# EAGLE design PosiBus (EAGLE 6.6.0)
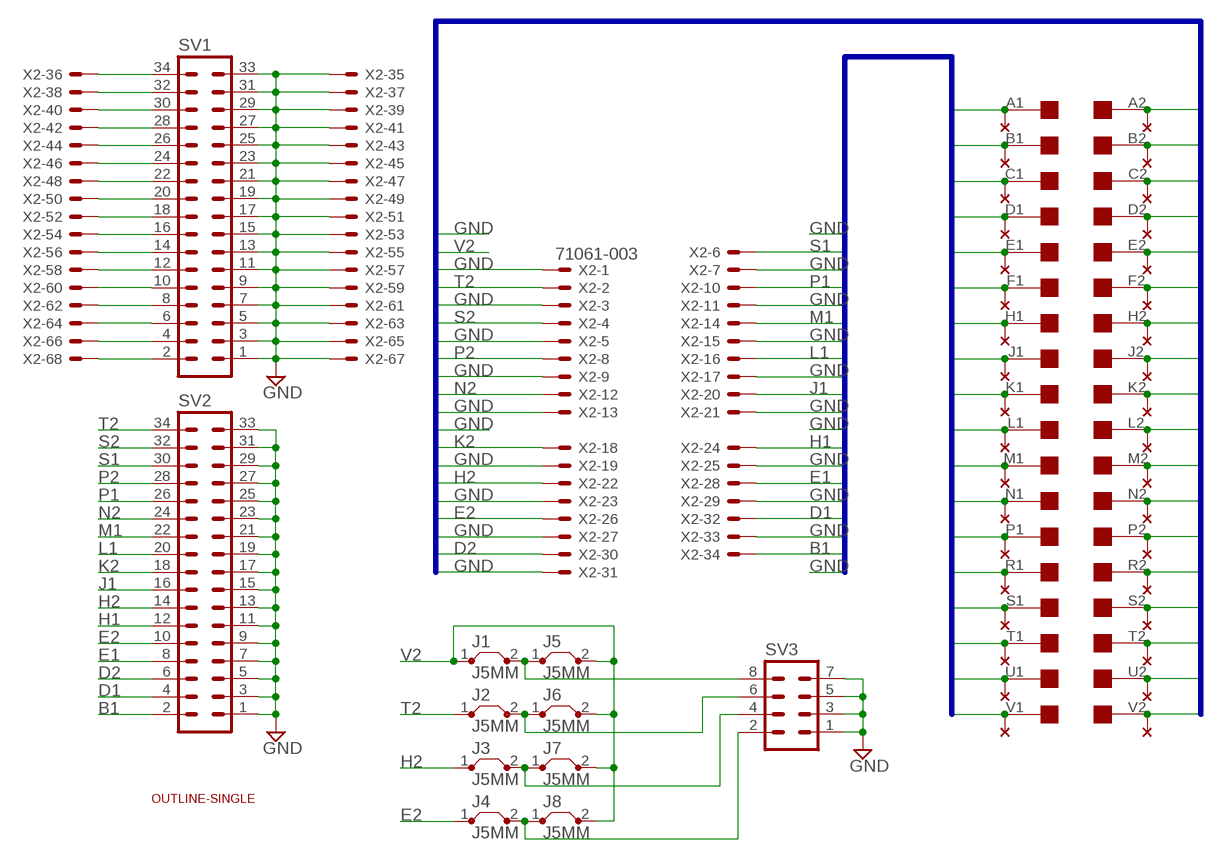
[diagram p0: schematic, sheet 1]

## Parts
EDGE1  EDGE-2CONNECTOR  [EDGE-CON2]
J1  J5MM  [05]
J2  J5MM  [05]
J3  J5MM  [05]
J4  J5MM  [05]
J5  J5MM  [05]
J6  J5MM  [05]
J7  J5MM  [05]
J8  J5MM  [05]
SV1  ML34  [ML34]
SV2  ML34  [ML34]
SV3  MA04-2  [MA04-2]
U$2  OUTLINE-SINGLE  [SINGLE]
U$3  THRU-HOLE2  [THRU-HOLEB]
X2  71061-003  [71061-0003]

## Nets
A2: EDGE1.A2 U$3.A2
B1: EDGE1.B1 SV2.2 U$3.B1 X2.34
B2: EDGE1.B2 U$3.B2
D1: EDGE1.D1 SV2.4 U$3.D1 X2.32
D2: EDGE1.D2 SV2.6 U$3.D2 X2.30
E1: EDGE1.E1 SV2.8 U$3.E1 X2.28
E2: EDGE1.E2 J4.1 SV2.10 U$3.E2 X2.26
GND [Ground]: EDGE1.A1 EDGE1.C1 EDGE1.C2 EDGE1.F1 EDGE1.F2 EDGE1.J2 EDGE1.K1 EDGE1.L2 EDGE1.M2 EDGE1.N1 EDGE1.R1 EDGE1.R2 EDGE1.T1 EDGE1.U2 SV1.1 SV1.3 SV1.5 SV1.7 SV1.9 SV1.11 SV1.13 SV1.15 SV1.17 SV1.19 SV1.21 SV1.23 SV1.25 SV1.27 SV1.29 SV1.31 SV1.33 SV2.1 SV2.3 SV2.5 SV2.7 SV2.9 SV2.11 SV2.13 SV2.15 SV2.17 SV2.19 SV2.21 SV2.23 SV2.25 SV2.27 SV2.29 SV2.31 SV2.33 SV3.1 SV3.3 SV3.5 SV3.7 U$3.A1 U$3.C1 U$3.C2 U$3.F1 U$3.F2 U$3.J2 U$3.K1 U$3.L2 U$3.M2 U$3.N1 U$3.R1 U$3.R2 U$3.T1 U$3.U2 X2.1 X2.3 X2.5 X2.7 X2.9 X2.11 X2.13 X2.15 X2.17 X2.19 X2.21 X2.23 X2.25 X2.27 X2.29 X2.31 X2.33 X2.35 X2.37 X2.39 X2.41 X2.43 X2.45 X2.47 X2.49 X2.51 X2.53 X2.55 X2.57 X2.59 X2.61 X2.63 X2.65 X2.67
H1: EDGE1.H1 SV2.12 U$3.H1 X2.24
H2: EDGE1.H2 J3.1 SV2.14 U$3.H2 X2.22
J1: EDGE1.J1 SV2.16 U$3.J1 X2.20
K2: EDGE1.K2 SV2.18 U$3.K2 X2.18
L1: EDGE1.L1 SV2.20 U$3.L1 X2.16
M1: EDGE1.M1 SV2.22 U$3.M1 X2.14
N2: EDGE1.N2 SV2.24 U$3.N2 X2.12
N$1: SV1.34 X2.36
N$2: SV1.4 X2.66
N$3: SV1.32 X2.38
N$4: SV1.30 X2.40
N$5: SV1.28 X2.42
N$6: SV1.26 X2.44
N$7: SV1.2 X2.68
N$8: J1.2 J5.1 SV3.8
N$9: J2.2 J6.1 SV3.6
N$10: J3.2 J7.1 SV3.4
N$11: SV1.24 X2.46
N$12: J4.2 J8.1 SV3.2
N$13: SV1.22 X2.48
N$14: SV1.20 X2.50
N$15: SV1.18 X2.52
N$16: SV1.16 X2.54
N$17: SV1.14 X2.56
N$23: SV1.12 X2.58
N$25: SV1.10 X2.60
N$27: SV1.8 X2.62
N$28: SV1.6 X2.64
P1: EDGE1.P1 SV2.26 U$3.P1 X2.10
P2: EDGE1.P2 SV2.28 U$3.P2 X2.8
S1: EDGE1.S1 SV2.30 U$3.S1 X2.6
S2: EDGE1.S2 SV2.32 U$3.S2 X2.4
T2: EDGE1.T2 J2.1 SV2.34 U$3.T2 X2.2
U1: EDGE1.U1 U$3.U1
V1: EDGE1.V1 U$3.V1
V2: EDGE1.V2 J1.1 J5.2 J6.2 J7.2 J8.2 U$3.V2

## Buses
A1,B1,C1,D1,E1,F1,H1,J1,K1,L1,M1,N1,P1,R1,S1,T1,U1,V1,GND
A2,B2,C2,D2,E2,F2,H2,J2,K2,L2,M2,N2,P2,R2,S2,T2,U2,V2,GND

## Library data of the parts
EDGE1 = dec-con:EDGE-2: Double-Sided DEC edge connector.
J1-J8 = jumper:J: Bridge
SV1 SV2 = con-harting-ml:ML34: HARTING; OC_FARNELL: unknown; OC_NEWARK: unknown
SV3 = con-lstb:MA04-2: PIN HEADER; OC_FARNELL: unknown; OC_NEWARK: unknown
U$2 = dec-con:OUTLINE-*: Board outlines for DEC boards.
U$3 = dec-con:THRU-HOLE2: Thru-Hole addition to double-sided edge connector.
X2 = con-molex:71061-003: CONNECTOR 68-pin 1.27mm (.050 inch) pitch SCSI+ unshielded receptacle right angle all plastic; OC_FARNELL: unknown; OC_NEWARK: unknown

## Board
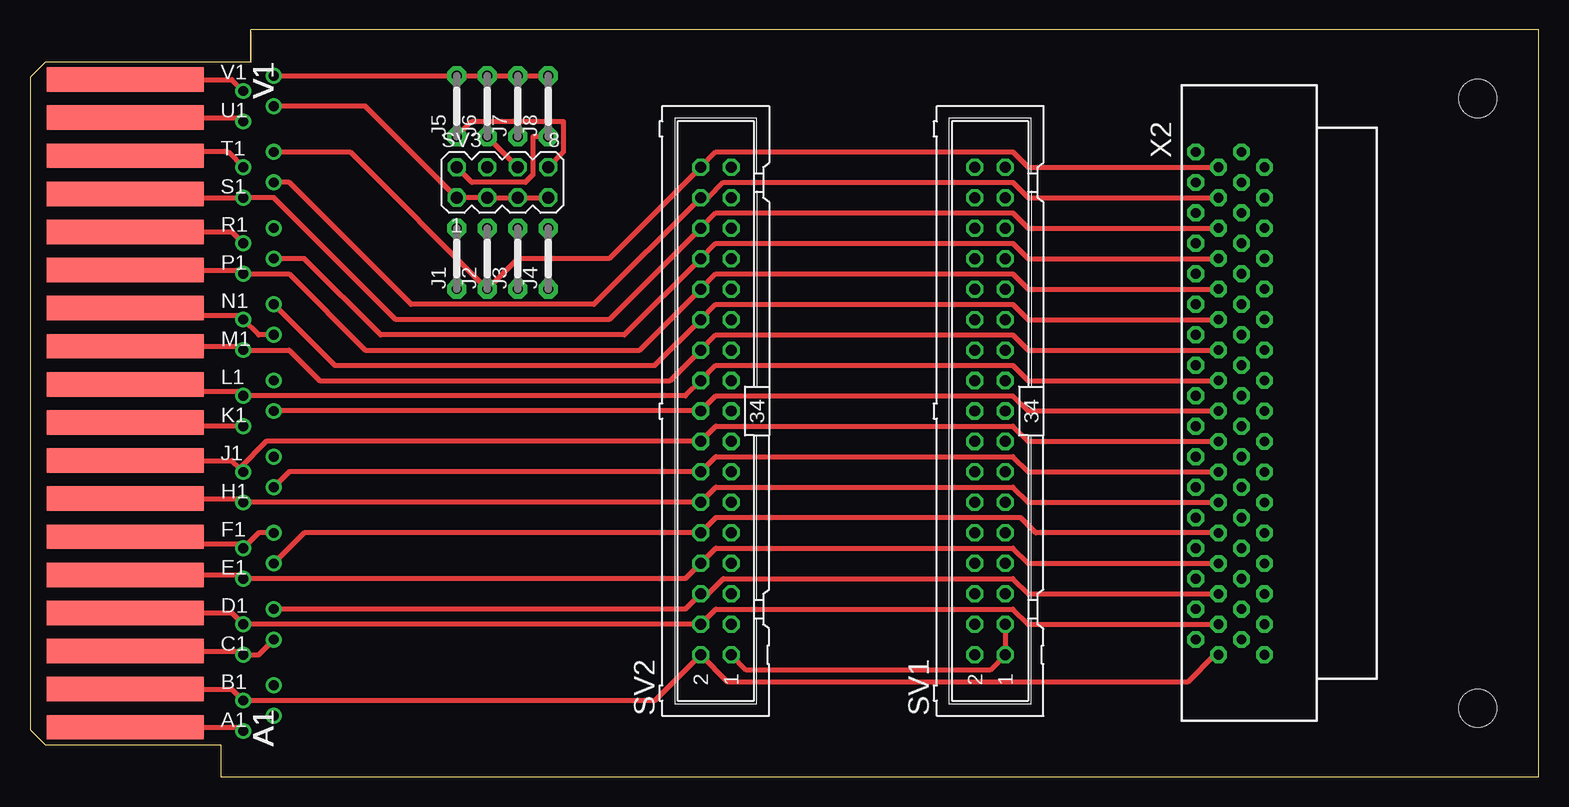
[diagram p1: board, top side]
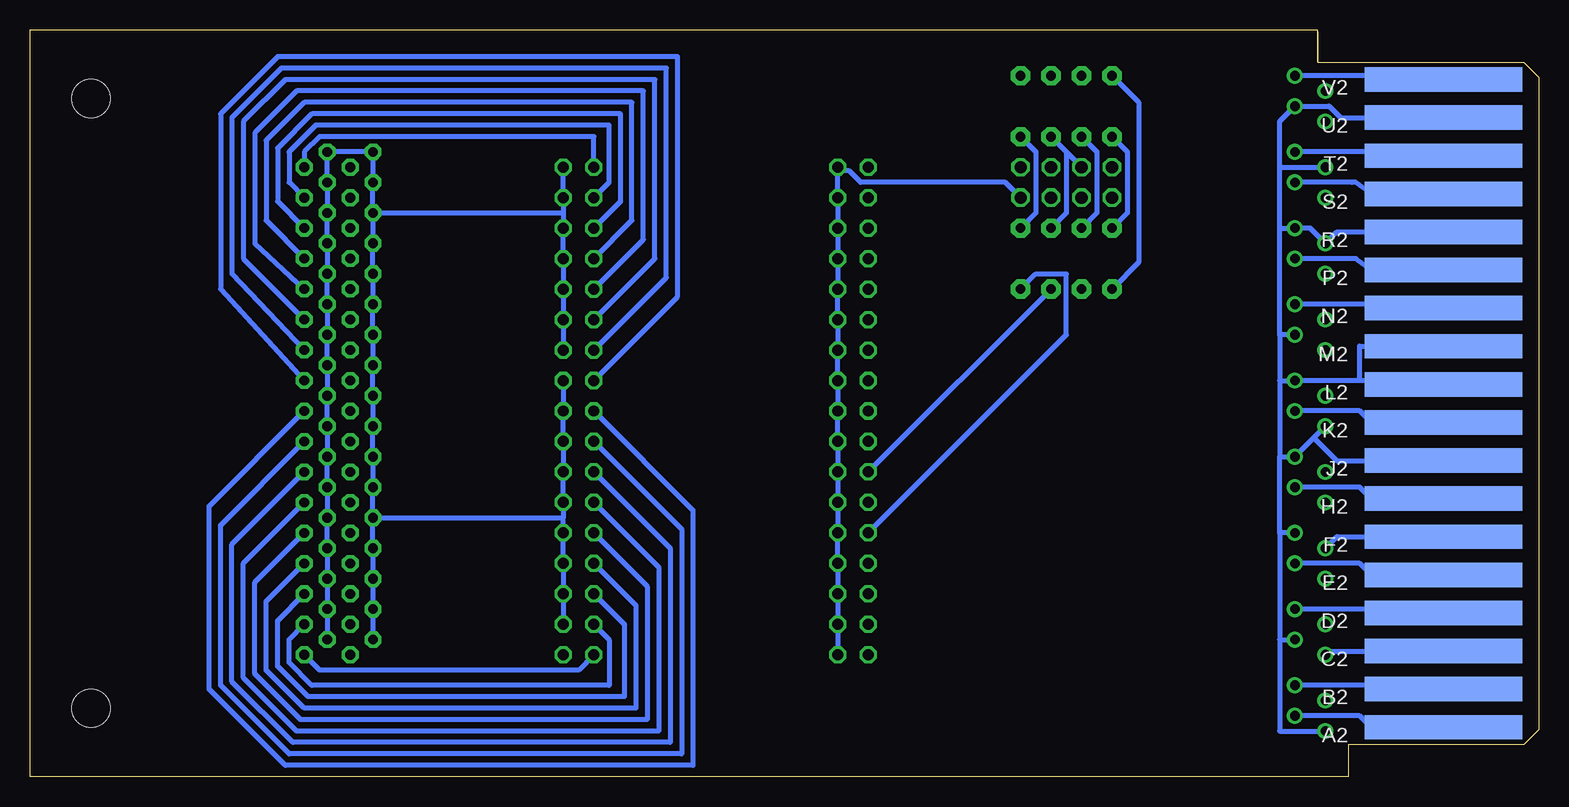
[diagram p2: board, bottom side, seen from below]

Size 125.73 x 62.23 mm. Coordinates in mm from the lower left corner, seen from the top.
Copper layers (1+16): Top 0.035mm / dielectric 1.5mm / Bottom 0.035mm
Design rules "16mils": minimum track width 16mil, minimum drill 32mil, track to track 15mil, track to pad 10mil, pad to pad 10mil, via to via 10mil, smd to smd 10mil, copper to edge 13mil, drill to drill 10mil, minimum pad ring 10mil, minimum via ring 8mil, stop-mask expansion 0mil, vias tented up to drill 0mil, thermal gap 10mil

### Footprints (pad centres in the part's own frame; a part is rotated, then mirrored left to right if it is on the bottom)
EDGE-CON2 = smd 13.106 x 2.032: A1 7.938,4.128; B1 7.938,7.303; C1 7.938,10.477; D1 7.938,13.652; E1 7.938,16.828; F1 7.938,20.003; H1 7.938,23.177; J1 7.938,26.352; K1 7.938,29.527; L1 7.938,32.703; M1 7.938,35.877; N1 7.938,39.053; P1 7.938,42.227; R1 7.938,45.403; S1 7.938,48.578; T1 7.938,51.752; U1 7.938,54.928; V1 7.938,58.102 | smd 13.106 x 2.032 bottom: A2 7.938,4.128; B2 7.938,7.303; C2 7.938,10.477; D2 7.938,13.652; E2 7.938,16.828; F2 7.938,20.003; H2 7.938,23.177; J2 7.938,26.352; K2 7.938,29.527; L2 7.938,32.703; M2 7.938,35.877; N2 7.938,39.053; P2 7.938,42.227; R2 7.938,45.403; S2 7.938,48.578; T2 7.938,51.752; U2 7.938,54.928; V2 7.938,58.102
05 = drill 0.813 pad 1.6 octagon: 1 -2.54,0; 2 2.54,0
ML34 = drill 0.914 octagon: 1 -20.32,-1.27; 2 -20.32,1.27; 3 -17.78,-1.27; 4 -17.78,1.27; 5 -15.24,-1.27; 6 -15.24,1.27; 7 -12.7,-1.27; 8 -12.7,1.27; 9 -10.16,-1.27; 10 -10.16,1.27; 11 -7.62,-1.27; 12 -7.62,1.27; 13 -5.08,-1.27; 14 -5.08,1.27; 15 -2.54,-1.27; 16 -2.54,1.27; 17 0,-1.27; 18 0,1.27; 19 2.54,-1.27; 20 2.54,1.27; 21 5.08,-1.27; 22 5.08,1.27; 23 7.62,-1.27; 24 7.62,1.27; 25 10.16,-1.27; 26 10.16,1.27; 27 12.7,-1.27; 28 12.7,1.27; 29 15.24,-1.27; 30 15.24,1.27; 31 17.78,-1.27; 32 17.78,1.27; 33 20.32,-1.27; 34 20.32,1.27
MA04-2 = drill 1.016 octagon: 1 -3.81,-1.27; 2 -3.81,1.27; 3 -1.27,-1.27; 4 -1.27,1.27; 5 1.27,-1.27; 6 1.27,1.27; 7 3.81,-1.27; 8 3.81,1.27
SINGLE = hole 3.175: 120.65,56.515; 120.65,5.715
THRU-HOLEB = drill 0.813 pad 1.27: A1 17.78,3.81; A2 20.32,5.08; B1 17.78,6.35; B2 20.32,7.62; C1 17.78,10.16; C2 20.32,11.43; D1 17.78,12.7; D2 20.32,13.97; E1 17.78,16.51; E2 20.32,17.78; F1 17.78,19.05; F2 20.32,20.32; H1 17.78,22.86; H2 20.32,24.13; J1 17.78,25.4; J2 20.32,26.67; K1 17.78,29.21; K2 20.32,30.48; L1 17.78,31.75; L2 20.32,33.02; M1 17.78,35.56; M2 20.32,36.83; N1 17.78,38.1; N2 20.32,39.37; P1 17.78,41.91; P2 20.32,43.18; R1 17.78,44.45; R2 20.32,45.72; S1 17.78,48.26; S2 20.32,49.53; T1 17.78,50.8; T2 20.32,52.07; U1 17.78,54.61; U2 20.32,55.88; V1 17.78,57.15; V2 20.32,58.42
71061-0003 = drill 0.813 pad 1.397 octagon: 1 -20.955,-5.73; 2 -19.685,-3.82; 3 -18.415,-5.73; 4 -17.145,-3.82; 5 -15.875,-5.73; 6 -14.605,-3.82; 7 -13.335,-5.73; 8 -12.065,-3.82; 9 -10.795,-5.73; 10 -9.525,-3.82; 11 -8.255,-5.73; 12 -6.985,-3.82; 13 -5.715,-5.73; 14 -4.445,-3.82; 15 -3.175,-5.73; 16 -1.905,-3.82; 17 -0.635,-5.73; 18 0.635,-3.82; 19 1.905,-5.73; 20 3.175,-3.82; 21 4.445,-5.73; 22 5.715,-3.82; 23 6.985,-5.73; 24 8.255,-3.82; 25 9.525,-5.73; 26 10.795,-3.82; 27 12.065,-5.73; 28 13.335,-3.82; 29 14.605,-5.73; 30 15.875,-3.82; 31 17.145,-5.73; 32 18.415,-3.82; 33 19.685,-5.73; 34 20.955,-3.82; 35 -20.955,-1.91; 36 -19.685,0; 37 -18.415,-1.91; 38 -17.145,0; 39 -15.875,-1.91; 40 -14.605,0; 41 -13.335,-1.91; 42 -12.065,0; 43 -10.795,-1.91; 44 -9.525,0; 45 -8.255,-1.91; 46 -6.985,0; 47 -5.715,-1.91; 48 -4.445,0; 49 -3.175,-1.91; 50 -1.905,0; 51 -0.635,-1.91; 52 0.635,0; 53 1.905,-1.91; 54 3.175,0; 55 4.445,-1.91; 56 5.715,0; 57 6.985,-1.91; 58 8.255,0; 59 9.525,-1.91; 60 10.795,0; 61 12.065,-1.91; 62 13.335,0; 63 14.605,-1.91; 64 15.875,0; 65 17.145,-1.91; 66 18.415,0; 67 19.685,-1.91; 68 20.955,0

### Placement (x,y rotation side)
EDGE1  0,0 0 top
J1  35.56,43.18 90 top
J2  38.1,43.18 90 top
J3  40.64,43.18 90 top
J4  43.18,43.18 90 top
J5  35.56,55.88 90 top
J6  38.1,55.88 90 top
J7  40.64,55.88 90 top
J8  43.18,55.88 90 top
SV1  80.01,30.48 90 top
SV2  57.15,30.48 90 top
SV3  39.37,49.53 0 top
U$2  0,0 0 top
U$3  0,0 0 top
X2  102.87,31.11 270 top

### Tracks (layer width: path | path; a pad name or v marks a point on that pad's centre or on a via)
A2
  Bottom 0.406: U$3.A2 14.92,5.08 13.97,4.13 EDGE1.A2
B1
  Top 0.406: EDGE1.B1 16.83,7.3 U$3.B1 52.07,6.35 SV2.2 58.1,7.94 96.52,7.94 98.74,10.16 X2.34
B2
  Bottom 0.406: U$3.B2 7.94,7.62 EDGE1.B2
D1
  Top 0.406: EDGE1.D1 16.83,13.65 U$3.D1 SV2.4 57.15,13.97 81.92,13.97 83.19,12.7 X2.32
D2
  Top 0.406: X2.30 83.19,15.24 81.92,16.51 57.79,16.51 56.52,15.24 SV2.6 54.61,13.97 U$3.D2
  Bottom 0.406: U$3.D2 7.94,13.97 EDGE1.D2
E1
  Top 0.406: EDGE1.E1 17.46,16.83 U$3.E1 54.61,16.51 SV2.8 57.15,19.05 81.92,19.05 83.19,17.78 X2.28
E2
  Top 0.406: U$3.E2 22.86,20.32 SV2.10 57.15,21.59 82.55,21.59 83.82,20.32 X2.26
  Bottom 0.406: U$3.E2 14.92,17.78 13.97,16.83 EDGE1.E2 | J4.1 41.91,41.91 39.37,41.91 39.37,36.83 SV2.10
GND
  Top 0.406: SV1.3 SV1.1 80.01,8.89 59.69,8.89 SV2.1 | U$3.M2 19.05,36.83 U$3.N1 17.46,38.42 8.57,38.42 EDGE1.N1 | 18.1,19.37 19.05,20.32 U$3.F2 | EDGE1.C1 17.46,10.48 U$3.C1 19.05,10.16 U$3.C2 | EDGE1.F1 8.57,19.37 18.1,19.37 | 18.1,19.37 U$3.F1 | SV3.7 SV3.5 SV3.3 SV3.1 27.94,55.88 U$3.U2 | U$3.R1 16.83,45.4 EDGE1.R1 | EDGE1.K1 8.26,29.21 U$3.K1 | U$3.A1 17.46,4.13 EDGE1.A1 | U$3.T1 16.51,52.07 8.26,52.07 EDGE1.T1
  Bottom 0.406: SV2.1 SV2.3 SV2.5 SV2.7 SV2.9 SV2.11 SV2.13 SV2.15 SV2.17 SV2.19 SV2.21 SV2.23 SV2.25 SV2.27 SV2.29 SV2.31 SV2.33 58.1,50.48 57.47,50.48 56.52,49.53 44.45,49.53 SV3.7 | SV1.19 SV1.17 SV1.15 SV1.13 SV1.11 81.28,21.59 | SV1.3 SV1.5 SV1.7 SV1.9 81.28,21.59 | X2.37 X2.39 | X2.37 X2.35 X2.1 97.16,52.07 97.16,49.53 | X2.37 | X2.41 X2.43 | X2.45 X2.47 | X2.49 X2.51 | X2.53 X2.55 | X2.57 X2.59 | X2.65 X2.67 | X2.61 X2.63 | X2.63 X2.65 | X2.65 | X2.63 | X2.61 X2.59 | X2.59 | X2.61 | X2.57 X2.55 | X2.55 | X2.57 | X2.53 X2.51 | X2.51 | X2.53 | X2.49 X2.47 | X2.47 | X2.49 | X2.45 X2.43 | X2.43 | X2.45 | X2.41 X2.39 | X2.39 | X2.41 | 81.28,46.99 SV1.31 SV1.33 | 81.28,46.99 SV1.29 SV1.27 SV1.25 SV1.23 SV1.21 | 97.16,46.99 97.16,44.45 | 97.16,41.91 97.16,39.37 | 97.16,36.83 97.16,34.29 | 97.16,31.75 97.16,29.21 | 97.16,26.67 97.16,24.13 | 97.16,13.97 97.16,11.43 X2.33 | 97.16,19.05 97.16,16.51 | 97.16,19.05 97.16,21.59 | 97.16,19.05 X2.27 | 97.16,16.51 97.16,13.97 | 97.16,13.97 X2.31 | 97.16,16.51 X2.29 | 97.16,21.59 97.16,24.13 | 97.16,24.13 X2.23 | 97.16,21.59 X2.25 81.28,21.59 | 97.16,26.67 97.16,29.21 | 97.16,29.21 X2.19 | 97.16,26.67 X2.21 | 97.16,31.75 97.16,34.29 | 97.16,34.29 X2.15 | 97.16,31.75 X2.17 | 97.16,36.83 97.16,39.37 | 97.16,39.37 X2.11 | 97.16,36.83 X2.13 | 97.16,41.91 97.16,44.45 | 97.16,44.45 X2.7 | 97.16,41.91 X2.9 | 97.16,46.99 97.16,49.53 | 97.16,49.53 X2.3 | 97.16,46.99 X2.5 81.28,46.99 | 18.73,28.26 U$3.J2 21.59,26.67 | 18.73,28.26 U$3.K1 | EDGE1.J2 16.83,26.35 18.73,28.26 | EDGE1.L2 13.97,33.02 14.92,33.02 | EDGE1.M2 14.92,35.88 14.92,33.02 | EDGE1.C1 17.78,10.48 U$3.C1 | EDGE1.F1 16.83,20 U$3.F1 | 21.59,20.32 21.59,26.67 | U$3.F2 21.59,20.32 | EDGE1.R1 16.83,45.4 U$3.R1 19.05,45.72 U$3.R2 21.59,45.72
  Bottom 0.406: EDGE1.U2 16.51,54.93 17.46,55.88 U$3.U2 21.59,54.61 21.59,50.8 | 21.59,33.02 21.59,26.67 | 21.59,36.83 21.59,45.72 | 21.59,11.43 U$3.C2 | 21.59,20.32 21.59,11.43 | U$3.A1 21.59,3.81 21.59,11.43 | 14.92,33.02 U$3.L2 21.59,33.02 | U$3.M2 21.59,36.83 | 21.59,36.83 21.59,33.02 | 21.59,50.8 U$3.T1 | 21.59,45.72 21.59,50.8
H1
  Top 0.406: EDGE1.H1 17.46,23.18 U$3.H1 SV2.12 57.15,24.13 81.92,24.13 83.19,22.86 X2.24
H2
  Top 0.406: X2.22 83.19,25.4 81.92,26.67 57.15,26.67 SV2.14 21.59,25.4 U$3.H2
  Bottom 0.406: U$3.H2 14.92,24.13 13.97,23.18 EDGE1.H2 | SV2.14 J3.1
J1
  Top 0.406: 17.46,25.72 16.83,26.35 EDGE1.J1 | X2.20 83.19,27.94 81.92,29.21 57.15,29.21 SV2.16 19.69,27.94 17.46,25.72 | 17.46,25.72 U$3.J1
K2
  Top 0.406: X2.18 83.19,30.48 81.92,31.75 57.15,31.75 SV2.18 U$3.K2
  Bottom 0.406: U$3.K2 14.92,30.48 13.97,29.53 EDGE1.K2
L1
  Top 0.406: X2.16 83.19,33.02 81.92,34.29 57.15,34.29 SV2.20 54.61,31.75 U$3.L1 17.46,32.07 8.57,32.07 EDGE1.L1
M1
  Top 0.406: EDGE1.M1 17.46,35.88 U$3.M1 21.59,35.56 24.13,33.02 53.34,33.02 SV2.22 57.15,36.83 81.92,36.83 83.19,35.56 X2.14
N2
  Top 0.406: X2.12 83.19,38.1 81.92,39.37 57.15,39.37 SV2.24 52.07,34.29 25.4,34.29 U$3.N2
  Bottom 0.406: U$3.N2 7.94,39.37 EDGE1.N2
N$1
  Bottom 0.406: X2.36 102.87,52.07 101.6,53.34 78.74,53.34 SV1.34
N$2
  Bottom 0.406: X2.66 104.14,11.43 104.14,9.53 102.24,7.62 77.47,7.62 77.47,11.43 SV1.4
N$3
  Bottom 0.406: X2.38 104.14,49.53 104.14,52.07 101.92,54.29 77.47,54.29 77.47,49.53 SV1.32
N$4
  Bottom 0.406: X2.40 105.09,47.94 105.09,52.39 102.24,55.24 76.52,55.24 76.52,47.94 SV1.30
N$5
  Bottom 0.406: X2.42 106.05,46.35 106.05,53.02 102.87,56.2 75.57,56.2 75.57,46.35 SV1.28
N$6
  Bottom 0.406: X2.44 107,44.45 107,53.66 103.51,57.15 74.61,57.15 74.61,44.77 SV1.26
N$7
  Bottom 0.406: SV1.2 80.01,8.89 101.6,8.89 X2.68
N$8
  Top 0.406: SV3.8 44.45,52.07 44.45,54.61 36.83,54.61 J5.1
  Bottom 0.406: J1.2 34.29,46.99 34.29,52.07 J5.1
N$9
  Top 0.406: J6.1 SV3.6
  Bottom 0.406: J2.2 36.83,46.99 36.83,52.07 J6.1
N$10
  Bottom 0.406: J7.1 39.37,52.07 | 39.37,52.07 SV3.4 | J3.2 39.37,46.99 39.37,52.07
N$11
  Bottom 0.406: X2.46 107.95,43.18 107.95,54.61 104.46,58.1 73.66,58.1 73.66,43.18 SV1.24
N$12
  Top 0.406: SV3.2 36.83,49.53 41.28,49.53 41.91,50.16 41.91,53.34 J8.1
  Bottom 0.406: J4.2 41.91,46.99 41.91,52.07 J8.1
N$13
  Bottom 0.406: X2.48 108.9,41.91 108.9,54.93 104.78,59.05 72.71,59.05 72.71,41.59 SV1.22
N$14
  Bottom 0.406: X2.50 109.86,40.64 109.86,55.24 105.09,60.01 71.76,60.01 71.76,40.01 SV1.20
N$15
  Bottom 0.406: X2.52 110.81,22.54 110.81,7.3 104.46,0.95 70.49,0.95 70.49,22.23 SV1.18
N$16
  Bottom 0.406: X2.54 109.86,20.95 109.86,7.62 104.14,1.91 71.44,1.91 71.44,20.64 SV1.16
N$17
  Bottom 0.406: X2.56 108.9,19.37 108.9,7.94 103.82,2.86 72.39,2.86 72.39,19.05 SV1.14
N$23
  Bottom 0.406: X2.58 107.95,17.78 107.95,8.26 103.51,3.81 73.34,3.81 73.34,17.46 SV1.12
N$25
  Bottom 0.406: X2.60 107,16.19 107,8.57 103.19,4.76 74.3,4.76 74.3,15.88 SV1.10
N$27
  Bottom 0.406: X2.62 106.05,14.61 106.05,8.89 102.87,5.71 75.25,5.71 75.25,14.29 SV1.8
N$28
  Bottom 0.406: X2.64 105.09,13.02 105.09,9.21 102.55,6.67 76.2,6.67 76.2,12.7 SV1.6
P1
  Top 0.406: EDGE1.P1 17.46,42.23 U$3.P1 21.59,41.91 27.94,35.56 50.8,35.56 SV2.26 57.15,41.91 81.92,41.91 83.19,40.64 X2.10
P2
  Top 0.406: X2.8 83.19,43.18 81.92,44.45 57.15,44.45 SV2.28 49.53,36.83 29.21,36.83 22.86,43.18 U$3.P2
  Bottom 0.406: U$3.P2 15.24,43.18 13.97,42.23 EDGE1.P2
S1
  Top 0.406: EDGE1.S1 14.29,48.26 U$3.S1 20.32,48.26 30.48,38.1 48.26,38.1 SV2.30 57.15,46.99 81.92,46.99 83.19,45.72 X2.6
S2
  Top 0.406: X2.4 83.19,48.26 81.92,49.53 57.79,49.53 56.52,48.26 SV2.32 46.99,39.37 31.75,39.37 21.59,49.53 U$3.S2
  Bottom 0.406: U$3.S2 15.56,49.53 15.24,49.53 13.97,48.58 EDGE1.S2
T2
  Top 0.406: X2.2 83.19,50.8 81.92,52.07 57.15,52.07 SV2.34 48.26,43.18 40.64,43.18 J2.1 26.67,52.07 U$3.T2
  Bottom 0.406: U$3.T2 7.94,52.07 EDGE1.T2
U1
  Top 0.406: U$3.U1 17.46,54.93 EDGE1.U1
V1
  Top 0.406: U$3.V1 16.83,58.1 EDGE1.V1
V2
  Top 0.406: J8.2 J7.2 J6.2 J5.2 U$3.V2
  Bottom 0.406: J1.1 33.34,42.86 33.34,56.2 J5.2 | U$3.V2 7.94,58.42 EDGE1.V2

### Text on the board
tNames: V1 | V1 | V1 | V1 | V1 | V1 | V1 | V1 | V1 | V1 | V1 | V1 | V1 | V1 | V1 | V1 | V1 | V1 | V1 | V1 | V1 | V1 | V1 | V1 | V1 | V1 | V1 | V1 | V1 | V1 | V1 | V1 | A1 | A1 | A1 | A1 | A1 | A1 | A1 | A1 | A1 | A1 | A1 | A1 | A1 | A1 | A1 | A1 | A1 | A1 | A1 | A1 | A1 | A1 | A1 | A1 | A1 | A1 | A1 | A1 | A1 | A1 | A1 | A1